# EAGLE design memoryboard5 (EAGLE 6.5.0)
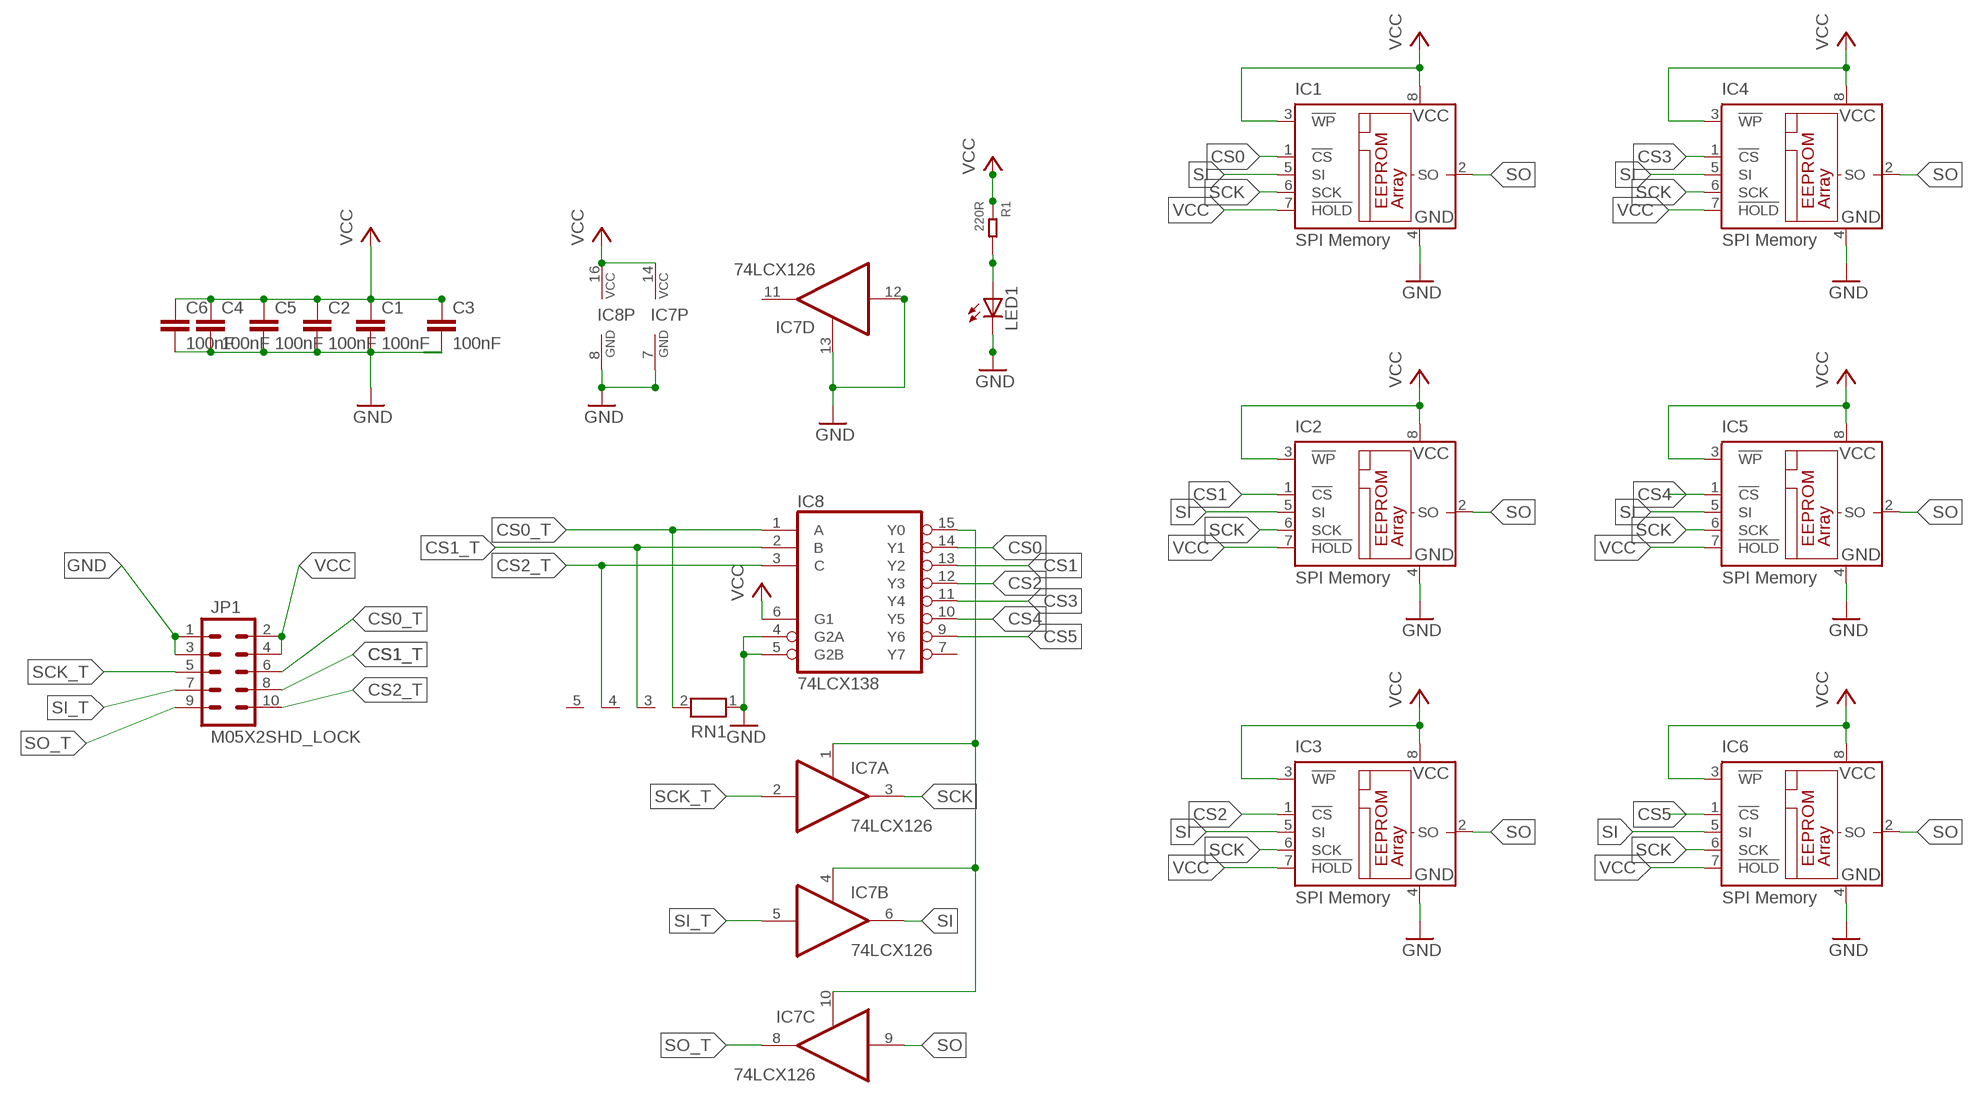
[diagram p0: schematic, sheet 1]

## Parts
C1  100nF  C-EUC0805  [C0805]
C2  100nF  C-EUC0805  [C0805]
C3  100nF  C-EUC0805  [C0805]
C4  100nF  C-EUC0805  [C0805]
C5  100nF  C-EUC0805  [C0805]
C6  100nF  C-EUC0805  [C0805]
IC1  SPI Memory  25LC080P  [DIL8]
IC2  SPI Memory  25LC080P  [DIL8]
IC3  SPI Memory  25LC080P  [DIL8]
IC4  SPI Memory  25LC080P  [DIL8]
IC5  SPI Memory  25LC080P  [DIL8]
IC6  SPI Memory  25LC080P  [DIL8]
IC7  74LCX126  74AC126N  [DIL14]
IC8  74LCX138  74HC138N  [DIL16]
JP1  M05X2SHD_LOCK  [2X5-SHROUDED_LOCK]
LED1  LED3MM  [LED3MM]
R1  220R  SMD-RES-220R-5%-1/8W(0805)  [R0805]
RN1  RN04  [RN-5]

## Nets
CS0: IC1.1(!CS) IC8.14(Y1)
CS0_T [SLOW]: IC8.1(A) JP1.6 RN1.2
CS1: IC2.1(!CS) IC8.13(Y2)
CS1_T [SLOW]: IC8.2(B) JP1.8 RN1.3
CS2: IC3.1(!CS) IC8.12(Y3)
CS2_T [SLOW]: IC8.3(C) JP1.10 RN1.4
CS3: IC4.1(!CS) IC8.11(Y4)
CS4: IC5.1(!CS) IC8.10(Y5)
CS5: IC6.1(!CS) IC8.9(Y6)
GND [SUPPLY]: C1.2 C2.2 C3.2 C4.2 C5.2 C6.2 IC1.4(GND) IC2.4(GND) IC3.4(GND) IC4.4(GND) IC5.4(GND) IC6.4(GND) IC7.7(P:GND) IC7.12(D:I) IC7.13(D:OE) IC8.4(G2A) IC8.5(G2B) IC8.8(GND) JP1.1 JP1.3 LED1.K(C) RN1.1
N$2 [SUPPLY]: LED1.A R1.2
SCK: IC1.6(SCK) IC2.6(SCK) IC3.6(SCK) IC4.6(SCK) IC5.6(SCK) IC6.6(SCK) IC7.3(A:O)
SCK_T: IC7.2(A:I) JP1.5
SI: IC1.5(SI) IC2.5(SI) IC3.5(SI) IC4.5(SI) IC5.5(SI) IC6.5(SI) IC7.6(B:O)
SI_T: IC7.5(B:I) JP1.7
SO: IC1.2(SO) IC2.2(SO) IC3.2(SO) IC4.2(SO) IC5.2(SO) IC6.2(SO) IC7.9(C:I)
SO_T: IC7.8(C:O) JP1.9
SPI_ENABLE: IC7.1(A:OE) IC7.4(B:OE) IC7.10(C:OE) IC8.15(Y0)
VCC [SUPPLY]: C1.1 C2.1 C3.1 C4.1 C5.1 C6.1 IC1.3(!WP) IC1.7(!HOLD) IC1.8(VCC) IC2.3(!WP) IC2.7(!HOLD) IC2.8(VCC) IC3.3(!WP) IC3.7(!HOLD) IC3.8(VCC) IC4.3(!WP) IC4.7(!HOLD) IC4.8(VCC) IC5.3(!WP) IC5.7(!HOLD) IC5.8(VCC) IC6.3(!WP) IC6.7(!HOLD) IC6.8(VCC) IC7.14(P:VCC) IC8.6(G1) IC8.16(VCC) JP1.2 JP1.4 R1.1
Unconnected: IC7.11(D:O) IC8.7(Y7) RN1.5

## Library data of the parts
C1-C6 = resistor:C-EU: CAPACITOR, European symbol
IC1-IC6 = microchip-update:25*: Serial EEPROM 4K/ 8K , SPI bus
IC7 = 74xx-eu:74*126: Quad bus BUFFER, 3-state
IC8 = 74xx-eu:74*138: 3-line to 8-line DECODER/DEMULTIPLEXER
JP1 = SparkFun:M05X2: Header 5x2 Standard 10-pin dual row 0.1" header. Commonly used with AVR-ISP. Use with Spark Fun Electronics SKU: PRT-00778
LED1 = SparkFun:LED: LEDs Standard schematic elements and footprints for 5mm, 3mm, 1206, and 0603 sized LEDs. 5mm - Spark Fun Electronics SKU : COM-00529 (and others)
R1 = Seeed-OPL-Resistor:SMD-RES-220R-5%-1/8W(0805): 301010315; MPN: RC0805JR-07220RL
RN1 = resistor-net:RN04: RESISTOR NETWORK; OC_FARNELL: unknown; OC_NEWARK: unknown

## Net classes
0 default: clearance 0.205 mm
1 SUPPLY: width 0.254 mm
2 SLOW: width 0.152 mm

## Board
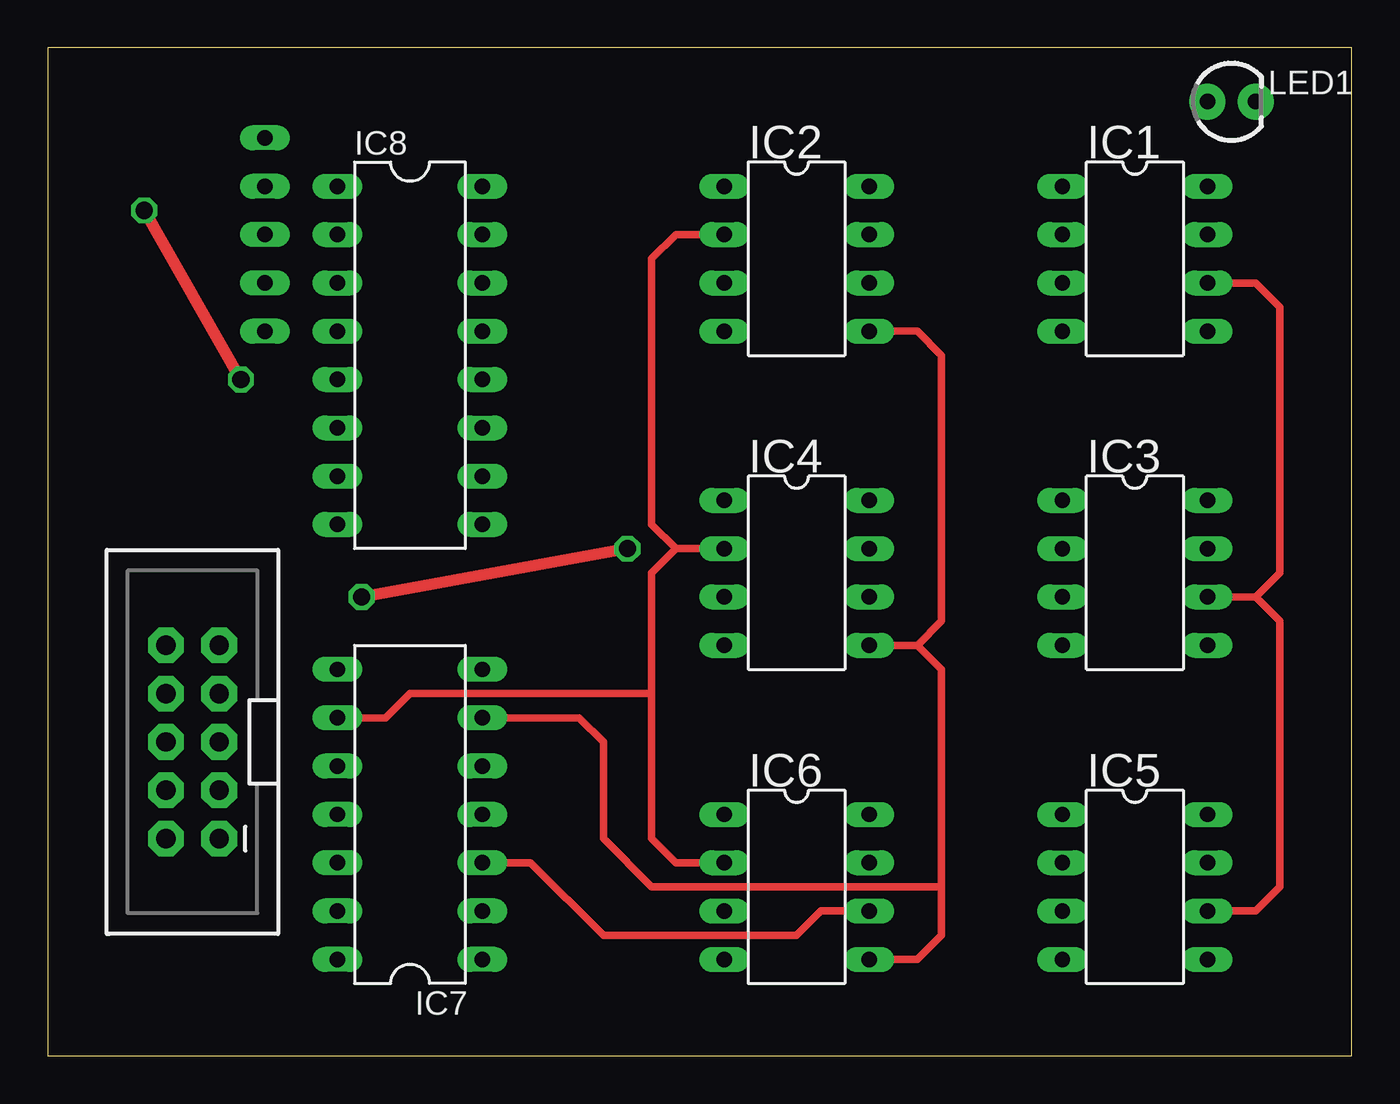
[diagram p1: board, top side]
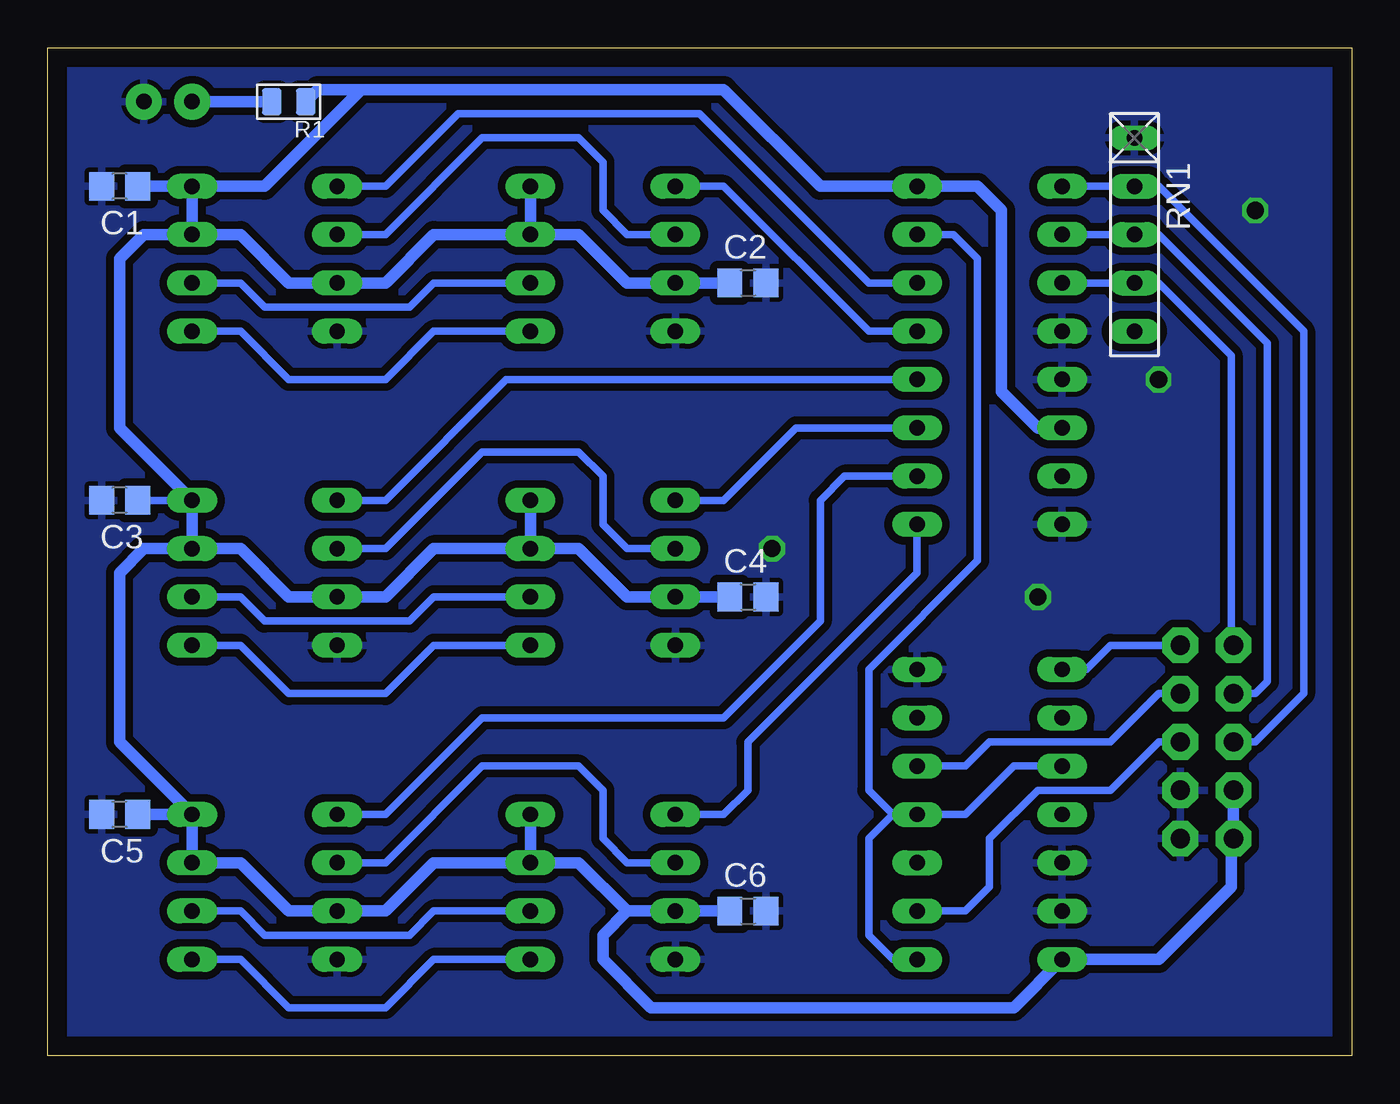
[diagram p2: board, bottom side, seen from below]

Size 68.56 x 53.01 mm. Coordinates in mm from the lower left corner, seen from the top.
Outline: 0,0 68.56,0 68.56,53.01 0,53.01 0,0
Copper layers (1*16): Top 0.035mm / dielectric 1.5mm / Bottom 0.035mm
Design rules "default": minimum track width 10mil, minimum drill 24mil, track to track 8mil, track to pad 8mil, pad to pad 8mil, via to via 8mil, smd to smd 8mil, copper to edge 40mil, drill to drill 8mil, minimum pad ring 10mil, minimum via ring 8mil, stop-mask expansion 4mil, vias tented up to drill 0mil, thermal gap 10mil

### Footprints (pad centres in the part's own frame; a part is rotated, then mirrored left to right if it is on the bottom)
C0805 = smd 1.3 x 1.5: 1 -0.95,0; 2 0.95,0
DIL8 = drill 0.813 long: 1 -3.81,-3.81; 2 -1.27,-3.81; 3 1.27,-3.81; 4 3.81,-3.81; 5 3.81,3.81; 6 1.27,3.81; 7 -1.27,3.81; 8 -3.81,3.81
DIL14 = drill 0.813 long: 1 -7.62,-3.81; 2 -5.08,-3.81; 3 -2.54,-3.81; 4 0,-3.81; 5 2.54,-3.81; 6 5.08,-3.81; 7 7.62,-3.81; 8 7.62,3.81; 9 5.08,3.81; 10 2.54,3.81; 11 0,3.81; 12 -2.54,3.81; 13 -5.08,3.81; 14 -7.62,3.81
DIL16 = drill 0.813 long: 1 -8.89,-3.81; 2 -6.35,-3.81; 3 -3.81,-3.81; 4 -1.27,-3.81; 5 1.27,-3.81; 6 3.81,-3.81; 7 6.35,-3.81; 8 8.89,-3.81; 9 8.89,3.81; 10 6.35,3.81; 11 3.81,3.81; 12 1.27,3.81; 13 -1.27,3.81; 14 -3.81,3.81; 15 -6.35,3.81; 16 -8.89,3.81
2X5-SHROUDED_LOCK = drill 1.016 pad 1.88 octagon: 1 -1.397,5.08; 2 1.397,5.08; 3 -1.397,2.54; 4 1.397,2.54; 5 -1.397,0; 6 1.397,0; 7 -1.397,-2.54; 8 1.397,-2.54; 9 -1.397,-5.08; 10 1.397,-5.08
LED3MM = drill 0.813 pad 1.88: A -1.27,0; K 1.27,0
R0805 = smd 1.397 x 1.016: 1 0,0.889; 2 0,-0.889
RN-5 = drill 0.813 long: 1 -5.08,0; 2 -2.54,0; 3 0,0; 4 2.54,0; 5 5.08,0

### Placement (x,y rotation side)
C1  64.77,45.72 180 bottom
C2  31.75,40.64 0 bottom
C3  64.77,29.21 180 bottom
C4  31.75,24.13 0 bottom
C5  64.77,12.7 180 bottom
C6  31.75,7.62 0 bottom
IC1  57.15,41.91 270 top
IC2  39.37,41.91 270 top
IC3  57.15,25.4 270 top
IC4  39.37,25.4 270 top
IC5  57.15,8.89 270 top
IC6  39.37,8.89 270 top
IC7  19.05,12.7 90 top
IC8  19.05,36.83 270 top
JP1  7.62,16.51 180 top
LED1  62.23,50.16 0 top
R1  55.88,50.16 270 bottom
RN1  11.43,43.18 270 bottom

### Tracks (layer width: path | path; a pad name or v marks a point on that pad's centre or on a via)
CS0
  Bottom 0.406: IC8.14 25.4,40.64 34.29,49.53 46.99,49.53 50.8,45.72 IC1.1
CS0_T
  Bottom 0.406: JP1.6 5.08,16.51 2.54,19.05 2.54,38.1 10.16,45.72 RN1.2 IC8.1
CS1
  Bottom 0.406: IC8.13 25.4,38.1 33.02,45.72 IC2.1
CS1_T
  Bottom 0.406: JP1.8 5.08,19.05 4.45,19.68 4.45,37.47 10.16,43.18 RN1.3 IC8.2
CS2
  Bottom 0.406: IC8.12 44.45,35.56 50.8,29.21 IC3.1
CS2_T
  Bottom 0.406: JP1.10 6.35,21.72 6.35,36.83 10.16,40.64 RN1.4 IC8.3
CS3
  Bottom 0.406: IC8.11 29.21,33.02 33.02,29.21 IC4.1
CS4
  Bottom 0.406: IC8.10 26.67,30.48 27.94,29.21 27.94,22.86 33.02,17.78 45.72,17.78 50.8,12.7 IC5.1
CS5
  Bottom 0.406: IC8.9 22.86,25.4 31.75,16.51 31.75,13.97 33.02,12.7 IC6.1
GND  (via drill 0.6, 0.9)
  Top 0.61: v10.16,35.56 v5.08,44.45 | v30.48,26.67 v16.51,24.13
  pour Bottom (isolate 0.406): 0,53.34 68.58,53.34 68.58,0 0,0
N$2
  Bottom 0.61: R1.2 LED1.A
SCK  (via drill 0.6)
  Top 0.406: IC5.6 63.5,7.62 64.77,8.89 64.77,22.86 63.5,24.13 | IC3.6 63.5,24.13 | 63.5,24.13 64.77,25.4 64.77,39.37 63.5,40.64 IC1.6 | IC7.3 25.4,10.16 29.21,6.35 39.37,6.35 40.64,7.62 IC6.6
  Bottom 0.406: IC6.6 48.26,7.62 49.53,6.35 57.15,6.35 58.42,7.62 IC5.6 | IC2.6 48.26,40.64 49.53,39.37 57.15,39.37 58.42,40.64 IC1.6 | IC4.6 48.26,24.13 49.53,22.86 57.15,22.86 58.42,24.13 IC3.6
  other vias: 60.96,7.62
SCK_T
  Bottom 0.406: IC7.2 20.32,7.62 19.05,8.89 19.05,11.43 16.51,13.97 12.7,13.97 10.16,16.51 JP1.5
SI
  Top 0.406: IC6.5 45.72,5.08 46.99,6.35 46.99,8.89 | 46.99,8.89 46.99,20.32 45.72,21.59 | IC4.5 45.72,21.59 | 45.72,21.59 46.99,22.86 46.99,36.83 45.72,38.1 IC2.5 | IC7.6 27.94,17.78 29.21,16.51 29.21,11.43 31.75,8.89 46.99,8.89
  Bottom 0.406: IC6.5 48.26,5.08 50.8,2.54 55.88,2.54 58.42,5.08 IC5.5 | IC2.5 48.26,38.1 50.8,35.56 55.88,35.56 58.42,38.1 IC1.5 | IC4.5 48.26,21.59 50.8,19.05 55.88,19.05 58.42,21.59 IC3.5
SI_T
  Bottom 0.406: IC7.5 20.32,15.24 19.05,16.51 12.7,16.51 10.16,19.05 JP1.7
SO  (via drill 0.6)
  Top 0.406: IC6.2 33.02,10.16 31.75,11.43 31.75,19.05 | 31.75,19.05 31.75,25.4 33.02,26.67 | 33.02,26.67 IC4.2 | IC2.2 33.02,43.18 31.75,41.91 31.75,27.94 33.02,26.67 | IC7.9 17.78,17.78 19.05,19.05 31.75,19.05
  Bottom 0.406: IC6.2 38.1,10.16 39.37,11.43 39.37,13.97 40.64,15.24 45.72,15.24 50.8,10.16 IC5.2 | IC4.2 38.1,26.67 39.37,27.94 39.37,30.48 40.64,31.75 45.72,31.75 50.8,26.67 IC3.2 | IC1.2 50.8,43.18 45.72,48.26 40.64,48.26 39.37,46.99 39.37,44.45 38.1,43.18 IC2.2
  other vias: 35.56,43.18
SO_T
  Bottom 0.406: IC7.8 13.97,20.32 12.7,21.59 JP1.9
SPI_ENABLE
  Bottom 0.406: IC8.15 20.95,43.18 19.68,41.91 19.68,26.03 25.4,20.32 25.4,13.97 24.13,12.7 | IC7.10 17.78,15.24 20.32,12.7 IC7.4 24.13,12.7 | IC7.1 24.13,5.08 25.4,6.35 25.4,11.43 24.13,12.7
VCC
  Bottom 0.406: C3.1 IC3.8 | 6.35,11.3 JP1.2
  Bottom 0.61: 38.1,7.62 IC6.3 C6.1 | 38.1,7.62 40.64,10.16 IC6.7 | IC6.7 48.26,10.16 50.8,7.62 IC5.3 55.88,7.62 58.42,10.16 IC5.7 IC5.8 | IC4.7 40.64,26.67 38.1,24.13 IC4.3 C4.1 | IC4.7 IC4.8 | IC4.7 48.26,26.67 50.8,24.13 IC3.3 55.88,24.13 58.42,26.67 IC3.7 | IC3.7 IC3.8 64.77,33.02 64.77,41.91 63.5,43.18 IC1.7 | IC1.8 IC1.7 | IC1.7 58.42,43.18 55.88,40.64 IC1.3 50.8,40.64 48.26,43.18 IC2.7 | IC2.8 IC2.7 | IC2.7 40.64,43.18 38.1,40.64 IC2.3 C2.1 | 52.07,50.8 33.02,50.8 27.94,45.72 IC8.16 19.68,45.72 18.41,44.45 18.41,34.92 16.51,33.02 IC8.6 | 52.07,50.8 57.15,45.72 IC1.8 | IC6.8 IC6.7 | IC5.8 64.77,16.51 64.77,25.4 63.5,26.67 IC3.7 | C1.1 IC1.8 | C5.1 IC5.8 | 38.1,7.62 39.37,6.35 39.37,5.08 36.83,2.54 17.78,2.54 IC7.14 10.16,5.08 6.35,8.89 6.35,11.3 | JP1.2 JP1.4 | 52.07,50.8 54.36,50.8 R1.1